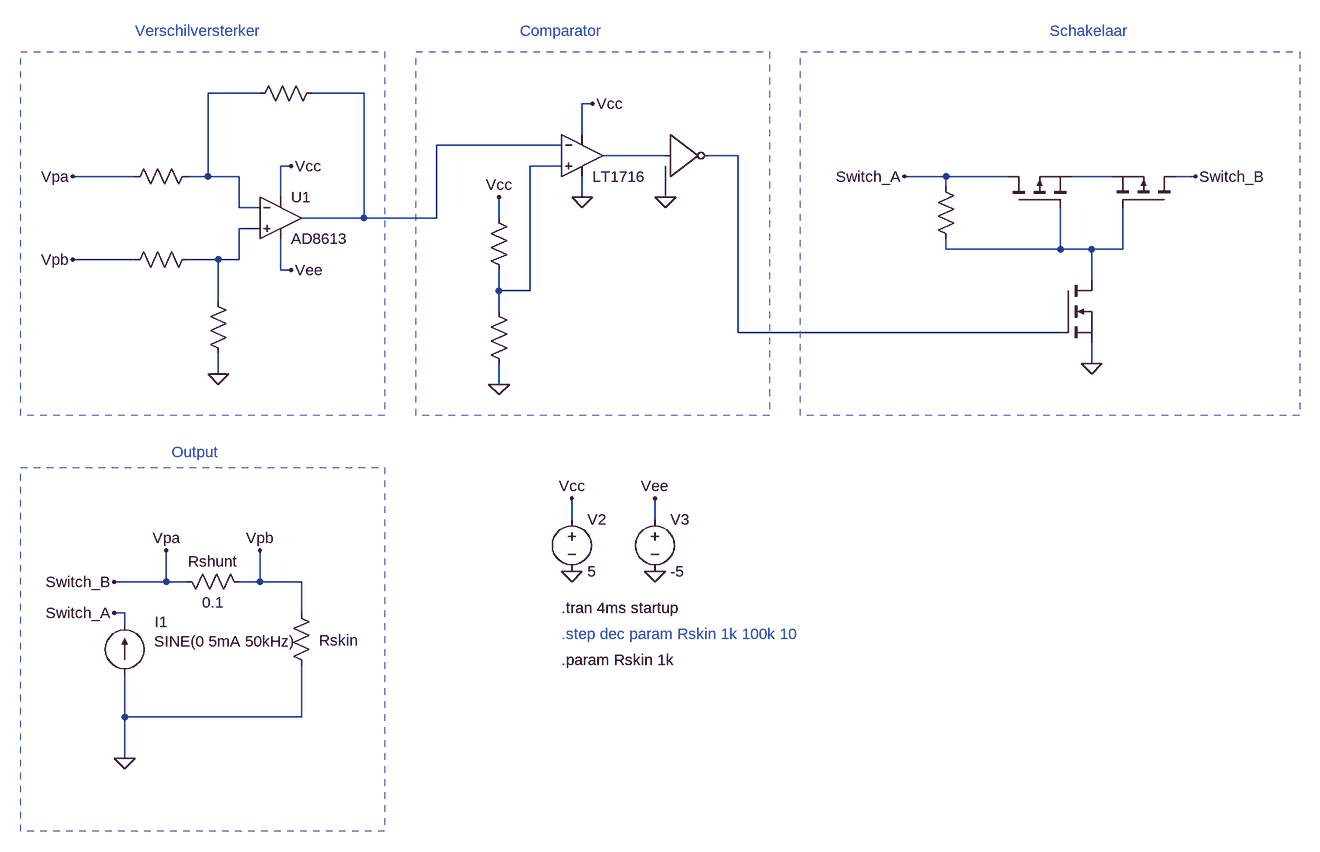
[diagram p0: schematic OCP_V01.asc]
OCP_V01.asc, the LTspice schematic file:
Version 4
SHEET 1 3572 1780
WIRE 1792 560 1712 560
WIRE 1952 560 1872 560
WIRE 2304 576 2288 576
WIRE 2288 624 2288 576
WIRE 2256 640 2064 640
WIRE 2416 656 2320 656
WIRE 2528 656 2480 656
WIRE 1840 672 1824 672
WIRE 2256 672 2208 672
WIRE 1600 688 1504 688
WIRE 1712 688 1712 560
WIRE 1712 688 1680 688
WIRE 1760 688 1712 688
WIRE 2848 688 2784 688
WIRE 2944 688 2848 688
WIRE 3104 688 3040 688
WIRE 3232 688 3200 688
WIRE 2848 704 2848 688
WIRE 1824 720 1824 672
WIRE 2288 720 2288 688
WIRE 2416 720 2416 672
WIRE 1760 736 1760 688
WIRE 1792 736 1760 736
WIRE 1952 752 1952 560
WIRE 1952 752 1856 752
WIRE 2064 752 2064 640
WIRE 2064 752 1952 752
WIRE 2160 752 2160 720
WIRE 1792 768 1760 768
WIRE 2848 800 2848 784
WIRE 3024 800 3024 736
WIRE 3024 800 2848 800
WIRE 3072 800 3024 800
WIRE 3120 800 3120 736
WIRE 3120 800 3072 800
WIRE 1600 816 1504 816
WIRE 1728 816 1680 816
WIRE 1760 816 1760 768
WIRE 1760 816 1728 816
WIRE 1824 832 1824 784
WIRE 1840 832 1824 832
WIRE 3072 848 3072 800
WIRE 2160 864 2160 832
WIRE 2208 864 2208 672
WIRE 2208 864 2160 864
WIRE 1728 880 1728 816
WIRE 2160 896 2160 864
WIRE 2528 928 2528 656
WIRE 3024 928 2528 928
WIRE 3072 976 3072 944
WIRE 1728 992 1728 960
WIRE 2160 1008 2160 976
WIRE 2272 1216 2272 1184
WIRE 2400 1216 2400 1184
WIRE 1648 1312 1648 1264
WIRE 1648 1312 1568 1312
WIRE 1680 1312 1648 1312
WIRE 1792 1312 1792 1264
WIRE 1792 1312 1760 1312
WIRE 1856 1312 1792 1312
WIRE 1584 1360 1568 1360
WIRE 1856 1360 1856 1312
WIRE 1584 1376 1584 1360
WIRE 1584 1520 1584 1456
WIRE 1856 1520 1856 1440
WIRE 1856 1520 1584 1520
WIRE 1584 1584 1584 1520
FLAG 1648 1264 Vpa
FLAG 1792 1264 Vpb
FLAG 2400 1296 0
FLAG 2272 1296 0
FLAG 2272 1184 Vcc
FLAG 2400 1184 Vee
FLAG 1840 672 Vcc
FLAG 1840 832 Vee
FLAG 1728 992 0
FLAG 1504 688 Vpa
FLAG 1584 1584 0
FLAG 1504 816 Vpb
FLAG 3072 976 0
FLAG 2304 576 Vcc
FLAG 2160 720 Vcc
FLAG 2160 1008 0
FLAG 2288 720 0
FLAG 2784 688 Switch_A
FLAG 3232 688 Switch_B
FLAG 1568 1360 Switch_A
FLAG 1568 1312 Switch_B
FLAG 2416 720 0
SYMBOL res 1664 1296 M90
WINDOW 0 0 56 VBottom 2
WINDOW 3 32 56 VTop 2
SYMATTR InstName Rshunt
SYMATTR Value 0.1
SYMBOL res 1840 1344 R0
WINDOW 0 43 58 Left 2
WINDOW 3 36 76 Invisible 2
SYMATTR InstName Rskin
SYMATTR Value {Rskin}
SYMBOL OpAmps\\AD8613 1824 688 R0
SYMATTR InstName U1
SYMBOL voltage 2272 1200 R0
SYMATTR InstName V2
SYMATTR Value 5
SYMBOL voltage 2400 1200 R0
SYMATTR InstName V3
SYMATTR Value -5
SYMBOL res 1712 864 R0
WINDOW 0 36 40 Invisible 2
WINDOW 3 36 76 Invisible 2
SYMATTR InstName RA4
SYMATTR Value 100k
SYMBOL res 1696 800 R90
WINDOW 0 0 56 Invisible 2
WINDOW 3 32 56 Invisible 2
SYMATTR InstName RA3
SYMATTR Value 100
SYMBOL res 1696 672 R90
WINDOW 0 0 56 Invisible 2
WINDOW 3 32 56 Invisible 2
SYMATTR InstName RA1
SYMATTR Value 100
SYMBOL res 1888 544 R90
WINDOW 0 0 56 Invisible 2
WINDOW 3 32 56 Invisible 2
SYMATTR InstName RA2
SYMATTR Value 100k
SYMBOL current 1584 1456 M180
WINDOW 0 46 82 Left 2
WINDOW 3 45 52 Left 2
WINDOW 123 0 0 Left 0
WINDOW 39 0 0 Left 0
SYMATTR InstName I1
SYMATTR Value SINE(0 5mA 50kHz)
SYMBOL pmos 2944 736 R270
WINDOW 0 56 32 Invisible 2
WINDOW 3 56 72 Invisible 2
SYMATTR InstName M1
SYMATTR Value Si7540DP_P
SYMBOL nmos 3024 848 R0
WINDOW 0 56 32 Invisible 2
WINDOW 3 56 72 Invisible 2
SYMATTR InstName M2
SYMATTR Value Si7540DP_N
SYMBOL pmos 3200 736 M270
WINDOW 0 56 32 Invisible 2
WINDOW 3 56 72 Invisible 2
SYMATTR InstName M3
SYMATTR Value Si7540DP_P
SYMBOL res 2176 848 R180
WINDOW 0 36 76 Invisible 2
WINDOW 3 36 40 Invisible 2
SYMATTR InstName R3
SYMATTR Value 500
SYMBOL res 2176 992 R180
WINDOW 0 36 76 Invisible 2
WINDOW 3 36 40 Invisible 2
SYMATTR InstName R4
SYMATTR Value 100
SYMBOL Comparators\\LT1716 2288 656 R0
WINDOW 0 16 -32 Invisible 2
SYMATTR InstName U3
SYMBOL res 2832 688 R0
WINDOW 0 36 40 Invisible 2
WINDOW 3 36 76 Invisible 2
SYMATTR InstName R1
SYMATTR Value 10k
SYMBOL Digital\\inv 2416 592 R0
WINDOW 0 8 32 Invisible 2
WINDOW 3 8 60 Invisible 2
SYMATTR InstName A2
SYMATTR Value Vhigh=5
TEXT 2256 1352 Left 2 !.tran 4ms startup
TEXT 1600 464 Left 2 ;Verschilversterker
TEXT 2192 464 Left 2 ;Comparator
TEXT 3008 464 Left 2 ;Schakelaar
TEXT 2256 1392 Left 2 ;.step dec param Rskin 1k 100k 10
TEXT 2256 1432 Left 2 !.param Rskin 1k
TEXT 1656 1112 Left 2 ;Output
RECTANGLE Normal 1984 1056 1424 496 2
RECTANGLE Normal 2576 1056 2032 496 2
RECTANGLE Normal 3392 1056 2624 496 2
RECTANGLE Normal 1984 1696 1424 1136 2

The netlist it stands for:
* OCP_V01.asc
Rshunt Switch_B Vpb 0.1
Rskin Vpb 0 {Rskin}
XU1 N007 N001 Vcc Vee N002 AD8613  ; pins In+ In- V+ V- OUT
V2 Vcc 0 5
V3 Vee 0 -5
RA4 N007 0 100k
RA3 N007 Vpb 100
RA1 N001 Switch_B 100
RA2 N002 N001 100k
I1 0 Switch_A SINE(0 5mA 50kHz)
M1 Switch_A N008 N006 N006 Si7540DP_P
M2 N008 N004 0 0 Si7540DP_N
M3 Switch_B N008 N006 N006 Si7540DP_P
R3 N005 Vcc 500
R4 0 N005 100
XU3 N005 N002 Vcc 0 N003 LT1716  ; pins In+ In- V+ V- OUT
R1 Switch_A N008 10k
A2 N003 0 0 0 0 N004 0 0 BUF Vhigh=5
.model NMOS NMOS
.model PMOS PMOS
.lib standard.mos
.tran 4ms startup
* Verschilversterker
* Comparator
* Schakelaar
* .step dec param Rskin 1k 100k 10
.param Rskin 1k
* Output
.lib LTC1.lib
.backanno
.end